# Altium project UHAL_TESTER_CONNECTOR_BREAKOUT.PrjPcb
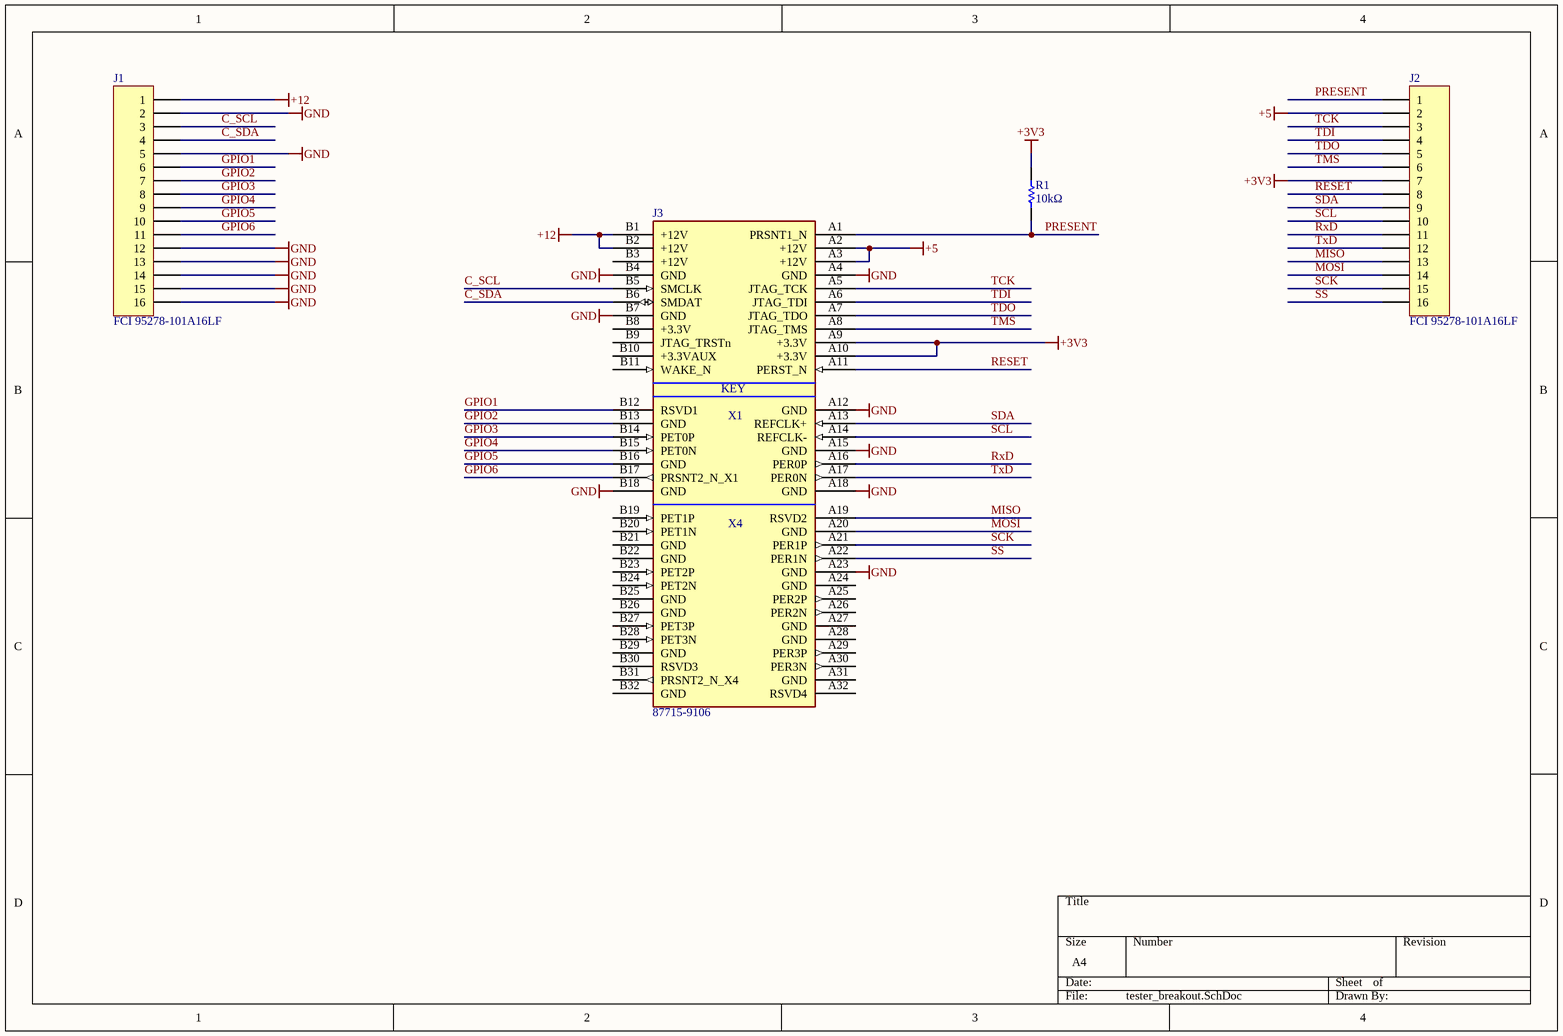
[diagram p0: tester_breakout.SchDoc]
1 sheet, 4 parts. Net scope: global (net labels, ports and power ports of the same name join across sheets).

## Sheet tester_breakout.SchDoc
size A4

### Parts
J1  FCI 95278-101A16LF  [PCB-4a2gbb28wmnqwy5o1l64-1]
J2  FCI 95278-101A16LF  [PCB-4a2gbb28wmnqwy5o1l64-1]
J3  87715-9106  [PCB-jv25kdr3228vq428mjlt-1]
R1  Resistance: 10kΩ  [PCB-a05eeaq2i5acw4uh0h7x-1]  (hidden comment: RES-2)

### Nets
+3V3: J2.7 J3.A9(+3.3V) J3.A10(+3.3V) R1.2
+5: J2.2 J3.A2(+12V) J3.A3(+12V)
+12: J1.1 J3.B1(+12V) J3.B2(+12V)
GND: J1.2 J1.5 J1.12 J1.13 J1.14 J1.15 J1.16 J3.A4(GND) J3.A12(GND) J3.A15(GND) J3.A18(GND) J3.A23(GND) J3.B4(GND) J3.B7(GND) J3.B18(GND)
C_SCL: J1.3 J3.B5(SMCLK)
C_SDA: J1.4 J3.B6(SMDAT)
GPIO1: J1.6 J3.B12(RSVD1)
GPIO2: J1.7 J3.B13(GND)
GPIO3: J1.8 J3.B14(PET0P)
GPIO4: J1.9 J3.B15(PET0N)
GPIO5: J1.10 J3.B16(GND)
GPIO6: J1.11 J3.B17(PRSNT2_N_X1)
MISO: J2.13 J3.A19(RSVD2)
MOSI: J2.14 J3.A20(GND)
PRESENT: J2.1 J3.A1(PRSNT1_N) R1.1
RESET: J2.8 J3.A11(PERST_N)
RxD: J2.11 J3.A16(PER0P)
SCK: J2.15 J3.A21(PER1P)
SCL: J2.10 J3.A14(REFCLK-)
SDA: J2.9 J3.A13(REFCLK+)
SS: J2.16 J3.A22(PER1N)
TCK: J2.3 J3.A5(JTAG_TCK)
TDI: J2.4 J3.A6(JTAG_TDI)
TDO: J2.5 J3.A7(JTAG_TDO)
TMS: J2.6 J3.A8(JTAG_TMS)
TxD: J2.12 J3.A17(PER0N)

Not connected (* = marked no-connect by the designer): J3 A24(GND) A25(PER2P) A26(PER2N) A27(GND) A28(GND) A29(PER3P) A30(PER3N) A31(GND) A32(RSVD4) B3(+12V) B8(+3.3V) B9(JTAG_TRSTn) B10(+3.3VAUX) B11(WAKE_N) B19(PET1P) B20(PET1N) B21(GND) B22(GND) B23(PET2P) B24(PET2N) B25(GND) B26(GND) B27(PET3P) B28(PET3N) B29(GND) B30(RSVD3) B31(PRSNT2_N_X4) B32(GND)

### Notes on the sheet
- (in symbol CMP-e234296465633df3-2) KEY; X1; X4

### Library data of the parts
J1 J2 = CMP-55f09e7f72328a37-7: Wire-To-Board Connector, Ampmodu Mod Ii Series, Through Hole, Header, 16, 2.54 Mm; Pin Pitch: 2.54 mm; Current Rating: 3.00 A; Gender: Male; Number of Contacts: 16; ELV Compliant: Compliant; Lead-Free Status: Lead Free; Packaging: Bulk; Contact Material: Phosphor Bronze; Octopart URL: https://octopart.com/825440-8-te+connectivity-42271396; REACH SVHC Compliance: No SVHC; Orientation: Vertical; Flammability Rating: UL 94 V-0; Housing Color: Green; Contact Plating: Tin, Gold over Nickel, Tin over Nickel, Gold; OctopartID: 55f09e7f72328a37; Color: Green; Operating Temperature: -65.0 °C to 105 °C
J3 = CMP-e234296465633df3-2: Conn PCI Express Card SKT 64 POS 2mm Solder ST Thru-Hole Tray; Pin Pitch: 1.00 mm; Size-Height: 11.2 mm; RoHS: Compliant; Housing Material: Nylon
R1 = CMP-4716668-21: Resistor; Thick Film; 10 Kilohms; 0.1 W; 1%; SMT; 0603; TCR 37 ppm/DegC; Tape and Reel; Manufacturer Part Number: CRCW060310K0FKEA; Lead-Free Status: Lead Free; Voltage Rating (DC): 75.0 V; Resistance Tolerance: ±1%; Octopart URL: http://octopart.com/crcw060310k0fkea-vishay-55388213; Packaging: Tape & Reel (TR), Cut Tape (CT); RoHS: Compliant; Size-Width: 850 µm; Case/Package: 0603; Mounting Style: Surface Mount; REACH SVHC Compliance: No SVHC; Number of Pins: 2; Size-Length: 1.55 mm; Size-Height: 450 µm